# Altium schematic sheet Interfaces.SchDoc
size A3; Author: M.Ricchieri; Organization: ETML-ES; Address1: Avenue Recordon 1; Address2: 1004 Lausanne; Address3: Switzerland; SheetNumber: 2; SheetTotal: 6
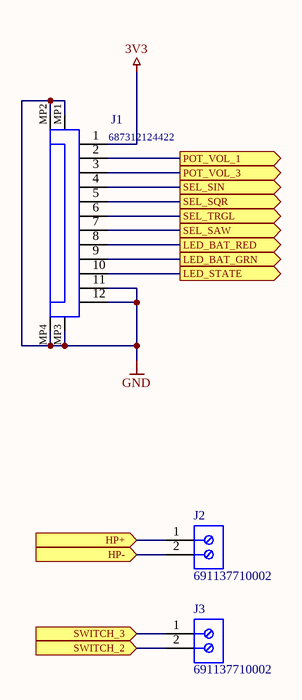
[diagram p0: Interfaces.SchDoc]

## Parts
J1  687312124422  [687312124422]
J2  691137710002  [691137710002]
J3  691137710002  [691137710002]

## Ports
HP+ (in), HP- (in), LED_BAT_GRN (out), LED_BAT_RED (out), LED_STATE (out), POT_VOL_1 (out), POT_VOL_3 (out), SEL_SAW (out), SEL_SIN (out), SEL_SQR (out), SEL_TRGL (out), SWITCH_2 (in), SWITCH_3 (in)

## Nets
3V3: J1.1
GND: J1.11 J1.12 J1.MP1 J1.MP2 J1.MP3 J1.MP4
HP+: J2.1 ; port HP+
HP-: J2.2 ; port HP-
LED_BAT_GRN: J1.9 ; port LED_BAT_GRN
LED_BAT_RED: J1.8 ; port LED_BAT_RED
LED_STATE: J1.10 ; port LED_STATE
POT_VOL_1: J1.2 ; port POT_VOL_1
POT_VOL_3: J1.3 ; port POT_VOL_3
SEL_SAW: J1.7 ; port SEL_SAW
SEL_SIN: J1.4 ; port SEL_SIN
SEL_SQR: J1.5 ; port SEL_SQR
SEL_TRGL: J1.6 ; port SEL_TRGL
SWITCH_2: J3.2 ; port SWITCH_2
SWITCH_3: J3.1 ; port SWITCH_3

## Notes on the sheet
- Fichier :
- a
- Date :
- Heure :
- Version :
- Auteur :
- Modif.
- b
- c
- d
- Projet :
- No :
- Nb feuilles
- Feuille n°
- Chemin :

## Library data of the parts
J1 = CMP-1502-01609-1: SMT ZIF Connectors WR-FPC, Vertical, Type A, pitch 0.5 mm, 12 pins; Manufacturer: Wurth Elektronik; Rated Current: 0.5A; Contact Design: TypeA; Withstanding Voltage: 250VAC; Contact Resistance: 20mOhm; Working Voltage: 50VAC; Pitch: 0.5mm; Pin Number: 12; Datasheet URL: https://katalog.we-online.de/em/datasheet/687312124422.pdf; Manufacturer URL: http://www.we-online.de; Publisher: WurthElektronik; Part Number: 687312124422; Operating Temperature: -25to85degC; Orientation: Vertical; Package Reference: 687312124422; Packaging: TapeandReel; Mounting Technology: SMT
J2 J3 = CMP-1502-03324-1: Series 1377 - 5.00 mm Horizontal Entry with Pressure Clamp WR-TBL, 2 pin; Manufacturer: Wurth Elektronik; Pin Number: 2; Pitch: 5.00mm; Operating Temperature: -30to120degC; Package Reference: 691137710002; Publisher: WurthElektronik; Mounting Technology: THT; Manufacturer URL: http://www.we-online.de; Packaging: Box; Part Number: 691137710002; Datasheet URL: http://katalog.we-online.de/pbs/datasheet/691137710002.pdf